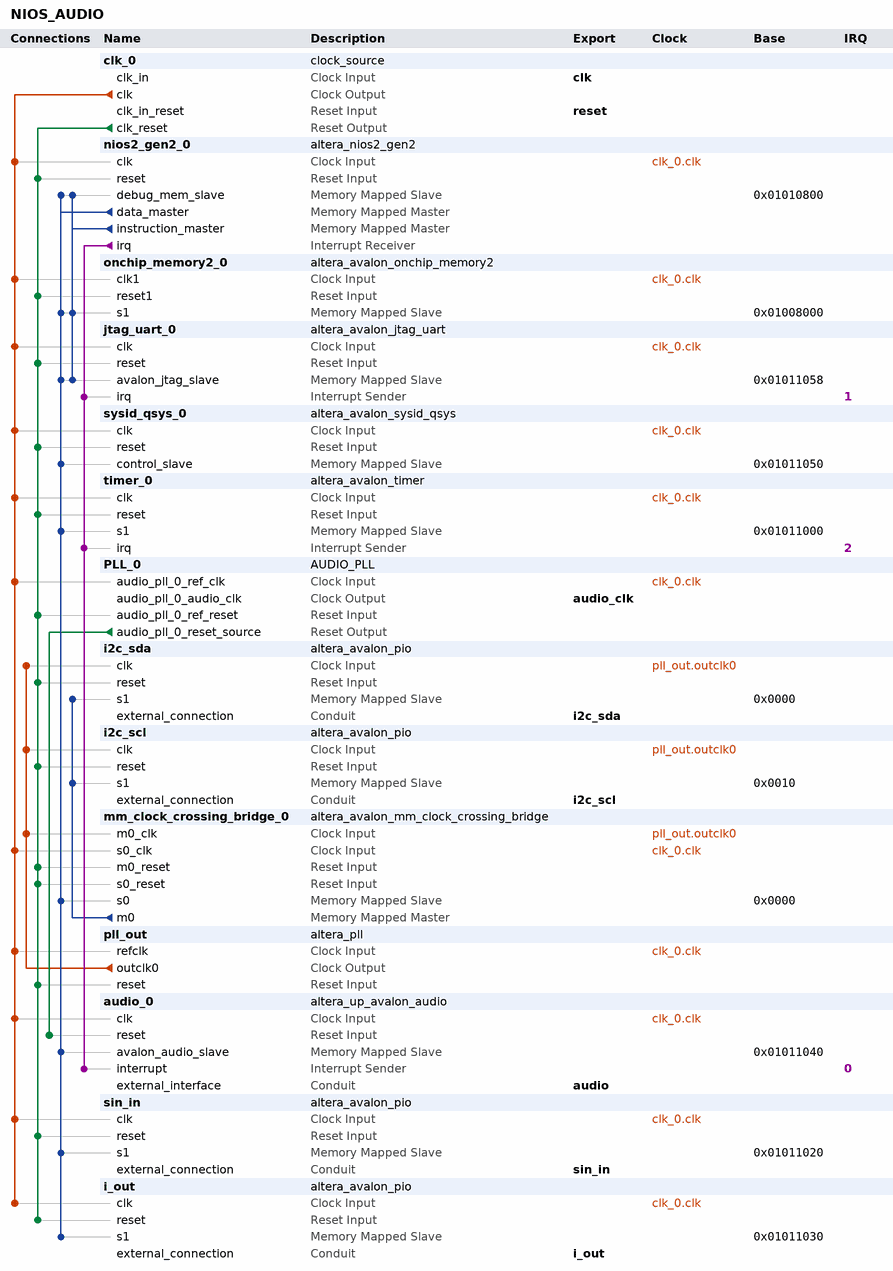
[diagram p0: system contents]
# Platform Designer (Qsys) system NIOS_AUDIO, Cyclone V 5CSEMA5F31C6
# Parameters at their usual value, and those the tool derives, are not listed.
package require -exact qsys 16.0
create_system NIOS_AUDIO
set_project_property DEVICE_FAMILY {Cyclone V}
set_project_property DEVICE 5CSEMA5F31C6

add_instance clk_0 clock_source 16.0
set_instance_parameter_value clk_0 clockFrequency 50000000

add_instance nios2_gen2_0 altera_nios2_gen2 16.0
set_instance_parameter_value nios2_gen2_0 dcache_size 2048
set_instance_parameter_value nios2_gen2_0 exceptionSlave onchip_memory2_0.s1
set_instance_parameter_value nios2_gen2_0 icache_size 4096
set_instance_parameter_value nios2_gen2_0 impl Fast
set_instance_parameter_value nios2_gen2_0 resetSlave onchip_memory2_0.s1

add_instance onchip_memory2_0 altera_avalon_onchip_memory2 16.0
set_instance_parameter_value onchip_memory2_0 dataWidth 32
set_instance_parameter_value onchip_memory2_0 dualPort false
set_instance_parameter_value onchip_memory2_0 initMemContent true
set_instance_parameter_value onchip_memory2_0 initializationFileName onchip_mem.hex
set_instance_parameter_value onchip_memory2_0 memorySize 32768

add_instance jtag_uart_0 altera_avalon_jtag_uart 16.0
set_instance_parameter_value jtag_uart_0 simInteractiveOptions NO_INTERACTIVE_WINDOWS

add_instance sysid_qsys_0 altera_avalon_sysid_qsys 16.0
set_instance_parameter_value sysid_qsys_0 id 65793

add_instance timer_0 altera_avalon_timer 16.0
set_instance_parameter_value timer_0 period 1
set_instance_parameter_value timer_0 periodUnits USEC

add_instance PLL_0 AUDIO_PLL 1.0

add_instance i2c_sda altera_avalon_pio 16.0
set_instance_parameter_value i2c_sda direction Bidir
set_instance_parameter_value i2c_sda width 1

add_instance i2c_scl altera_avalon_pio 16.0
set_instance_parameter_value i2c_scl direction Output
set_instance_parameter_value i2c_scl width 1

add_instance mm_clock_crossing_bridge_0 altera_avalon_mm_clock_crossing_bridge 16.0
set_instance_parameter_value mm_clock_crossing_bridge_0 ADDRESS_WIDTH 9
set_instance_parameter_value mm_clock_crossing_bridge_0 COMMAND_FIFO_DEPTH 32
set_instance_parameter_value mm_clock_crossing_bridge_0 DATA_WIDTH 32
set_instance_parameter_value mm_clock_crossing_bridge_0 MASTER_SYNC_DEPTH 3
set_instance_parameter_value mm_clock_crossing_bridge_0 MAX_BURST_SIZE 1
set_instance_parameter_value mm_clock_crossing_bridge_0 RESPONSE_FIFO_DEPTH 64
set_instance_parameter_value mm_clock_crossing_bridge_0 SLAVE_SYNC_DEPTH 3
set_instance_parameter_value mm_clock_crossing_bridge_0 USE_AUTO_ADDRESS_WIDTH 0

add_instance pll_out altera_pll 16.0
set_instance_parameter_value pll_out gui_device_speed_grade 1
set_instance_parameter_value pll_out gui_number_of_clocks 1
set_instance_parameter_value pll_out gui_operation_mode direct
set_instance_parameter_value pll_out gui_output_clock_frequency0 10.0
set_instance_parameter_value pll_out gui_pll_mode {Integer-N PLL}
set_instance_parameter_value pll_out gui_reference_clock_frequency 50.0
set_instance_parameter_value pll_out gui_use_locked false

add_instance audio_0 altera_up_avalon_audio 15.1
set_instance_parameter_value audio_0 audio_in true
set_instance_parameter_value audio_0 avalon_bus_type {Memory Mapped}
set_instance_parameter_value audio_0 dw 16

add_instance sin_in altera_avalon_pio 16.0
set_instance_parameter_value sin_in direction Input
set_instance_parameter_value sin_in width 32

add_instance i_out altera_avalon_pio 16.0
set_instance_parameter_value i_out direction Output
set_instance_parameter_value i_out width 32

# connections
add_connection clk_0.clk audio_0.clk clock
add_connection clk_0.clk i_out.clk clock
add_connection clk_0.clk jtag_uart_0.clk clock
add_connection clk_0.clk mm_clock_crossing_bridge_0.s0_clk clock
add_connection clk_0.clk nios2_gen2_0.clk clock
add_connection clk_0.clk onchip_memory2_0.clk1 clock
add_connection clk_0.clk PLL_0.audio_pll_0_ref_clk clock
add_connection clk_0.clk pll_out.refclk clock
add_connection clk_0.clk sin_in.clk clock
add_connection clk_0.clk sysid_qsys_0.clk clock
add_connection clk_0.clk timer_0.clk clock
add_connection pll_out.outclk0 i2c_scl.clk clock
add_connection pll_out.outclk0 i2c_sda.clk clock
add_connection pll_out.outclk0 mm_clock_crossing_bridge_0.m0_clk clock
add_connection clk_0.clk_reset i2c_scl.reset reset
add_connection clk_0.clk_reset i2c_sda.reset reset
add_connection clk_0.clk_reset i_out.reset reset
add_connection clk_0.clk_reset jtag_uart_0.reset reset
add_connection clk_0.clk_reset mm_clock_crossing_bridge_0.m0_reset reset
add_connection clk_0.clk_reset mm_clock_crossing_bridge_0.s0_reset reset
add_connection clk_0.clk_reset nios2_gen2_0.reset reset
add_connection clk_0.clk_reset onchip_memory2_0.reset1 reset
add_connection clk_0.clk_reset PLL_0.audio_pll_0_ref_reset reset
add_connection clk_0.clk_reset pll_out.reset reset
add_connection clk_0.clk_reset sin_in.reset reset
add_connection clk_0.clk_reset sysid_qsys_0.reset reset
add_connection clk_0.clk_reset timer_0.reset reset
add_connection PLL_0.audio_pll_0_reset_source audio_0.reset reset
add_connection mm_clock_crossing_bridge_0.m0 i2c_scl.s1 avalon
set_connection_parameter_value mm_clock_crossing_bridge_0.m0/i2c_scl.s1 baseAddress 0x0010
add_connection mm_clock_crossing_bridge_0.m0 i2c_sda.s1 avalon
set_connection_parameter_value mm_clock_crossing_bridge_0.m0/i2c_sda.s1 baseAddress 0x0000
add_connection nios2_gen2_0.data_master audio_0.avalon_audio_slave avalon
set_connection_parameter_value nios2_gen2_0.data_master/audio_0.avalon_audio_slave baseAddress 0x01011040
add_connection nios2_gen2_0.data_master i_out.s1 avalon
set_connection_parameter_value nios2_gen2_0.data_master/i_out.s1 baseAddress 0x01011030
add_connection nios2_gen2_0.data_master jtag_uart_0.avalon_jtag_slave avalon
set_connection_parameter_value nios2_gen2_0.data_master/jtag_uart_0.avalon_jtag_slave baseAddress 0x01011058
add_connection nios2_gen2_0.data_master mm_clock_crossing_bridge_0.s0 avalon
set_connection_parameter_value nios2_gen2_0.data_master/mm_clock_crossing_bridge_0.s0 baseAddress 0x0000
add_connection nios2_gen2_0.data_master nios2_gen2_0.debug_mem_slave avalon
set_connection_parameter_value nios2_gen2_0.data_master/nios2_gen2_0.debug_mem_slave baseAddress 0x01010800
add_connection nios2_gen2_0.data_master onchip_memory2_0.s1 avalon
set_connection_parameter_value nios2_gen2_0.data_master/onchip_memory2_0.s1 baseAddress 0x01008000
add_connection nios2_gen2_0.data_master sin_in.s1 avalon
set_connection_parameter_value nios2_gen2_0.data_master/sin_in.s1 baseAddress 0x01011020
add_connection nios2_gen2_0.data_master sysid_qsys_0.control_slave avalon
set_connection_parameter_value nios2_gen2_0.data_master/sysid_qsys_0.control_slave baseAddress 0x01011050
add_connection nios2_gen2_0.data_master timer_0.s1 avalon
set_connection_parameter_value nios2_gen2_0.data_master/timer_0.s1 baseAddress 0x01011000
add_connection nios2_gen2_0.instruction_master jtag_uart_0.avalon_jtag_slave avalon
set_connection_parameter_value nios2_gen2_0.instruction_master/jtag_uart_0.avalon_jtag_slave baseAddress 0x01011058
add_connection nios2_gen2_0.instruction_master nios2_gen2_0.debug_mem_slave avalon
set_connection_parameter_value nios2_gen2_0.instruction_master/nios2_gen2_0.debug_mem_slave baseAddress 0x01010800
add_connection nios2_gen2_0.instruction_master onchip_memory2_0.s1 avalon
set_connection_parameter_value nios2_gen2_0.instruction_master/onchip_memory2_0.s1 baseAddress 0x01008000
add_connection nios2_gen2_0.irq audio_0.interrupt interrupt
set_connection_parameter_value nios2_gen2_0.irq/audio_0.interrupt irqNumber 0
add_connection nios2_gen2_0.irq jtag_uart_0.irq interrupt
set_connection_parameter_value nios2_gen2_0.irq/jtag_uart_0.irq irqNumber 1
add_connection nios2_gen2_0.irq timer_0.irq interrupt
set_connection_parameter_value nios2_gen2_0.irq/timer_0.irq irqNumber 2

# exported interfaces
add_interface audio conduit end
set_interface_property audio EXPORT_OF audio_0.external_interface
add_interface audio_clk clock source
set_interface_property audio_clk EXPORT_OF PLL_0.audio_pll_0_audio_clk
add_interface clk clock sink
set_interface_property clk EXPORT_OF clk_0.clk_in
add_interface i2c_scl conduit end
set_interface_property i2c_scl EXPORT_OF i2c_scl.external_connection
add_interface i2c_sda conduit end
set_interface_property i2c_sda EXPORT_OF i2c_sda.external_connection
add_interface i_out conduit end
set_interface_property i_out EXPORT_OF i_out.external_connection
add_interface reset reset sink
set_interface_property reset EXPORT_OF clk_0.clk_in_reset
add_interface sin_in conduit end
set_interface_property sin_in EXPORT_OF sin_in.external_connection

set_interconnect_requirement {$system} qsys_mm.clockCrossingAdapter HANDSHAKE
set_interconnect_requirement {$system} qsys_mm.enableEccProtection FALSE
set_interconnect_requirement {$system} qsys_mm.insertDefaultSlave FALSE
set_interconnect_requirement {$system} qsys_mm.maxAdditionalLatency 1

save_system NIOS_AUDIO.qsys
